# Altium schematic sheet MotherBoard_Measure_Communication.SchDoc
size A; SheetNumber: 6; SheetTotal: 9
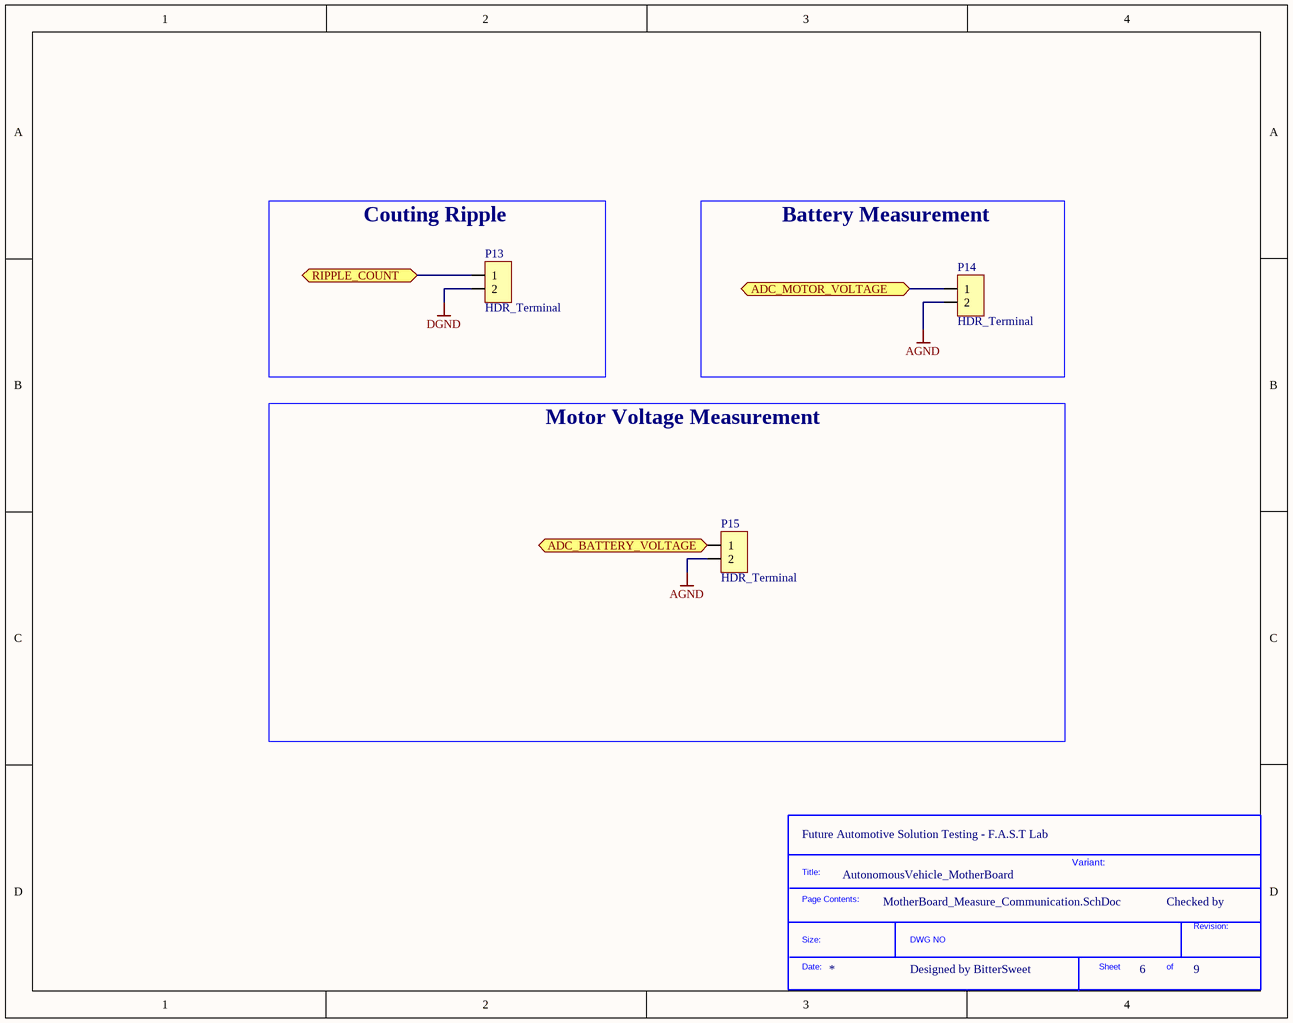
[diagram p0: MotherBoard_Measure_Communication.SchDoc]

## Parts
*?  SDTitleBlock  (value not drawn)  (graphical)
P13  HDR_Terminal  [HDR_HEADER_2.0_HORIZONTAL]
P14  HDR_Terminal  [HDR_HEADER_2.0_HORIZONTAL]
P15  HDR_Terminal  [HDR_HEADER_2.0_HORIZONTAL]

## Blocks framed on the sheet
Couting Ripple: P13
Battery Measurement: P14
Motor Voltage Measurement: P15

## Ports
ADC_BATTERY_VOLTAGE (bidir), ADC_MOTOR_VOLTAGE (bidir), RIPPLE_COUNT (bidir)

## Nets
AGND: P14.2 P15.2
DGND: P13.2
ADC_BATTERY_VOLTAGE: P15.1 ; port ADC_BATTERY_VOLTAGE
ADC_MOTOR_VOLTAGE: P14.1 ; port ADC_MOTOR_VOLTAGE
RIPPLE_COUNT: P13.1 ; port RIPPLE_COUNT

## Notes on the sheet
- (near *?) Future Automotive Solution Testing - F.A.S.T Lab
- AutonomousVehicle_MotherBoard
- Variant:
- Checked by
- Designed by BitterSweet
- (in symbol SDTitleBlock) Title:; Page Contents:; Revision:; Size:; DWG NO; Date:; Sheet; of

## Library data of the parts
P13-P15 = HDR_Terminal: HDR_Terminal 2 pin; Supplier: ThegioiIC; ComponentLink1Description: URL; ComponentLink1URL: https://www.thegioiic.com/kf128-2-v-domino-2-chan-thang-3-5mm-300v-10a-han-pcb